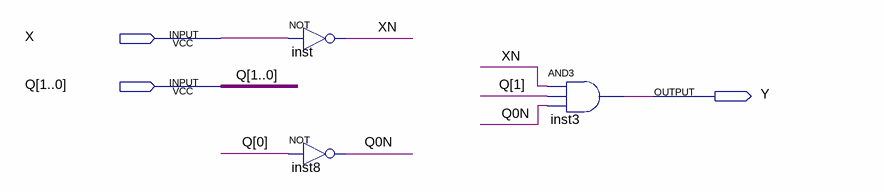
[diagram p0: schematic sheet]
// Quartus schematic OUTPUT_2.bdf as structural Verilog: 3 symbols, 3 pins
module OUTPUT_2 (
  input  X,
  input  [1:0] Q,
  output Y
);

  wire Q0N, XN;

  not inst (XN, X);
  not inst8 (Q0N, Q[0]);
  and inst3 (Y, XN, Q[1], Q0N);
endmodule
